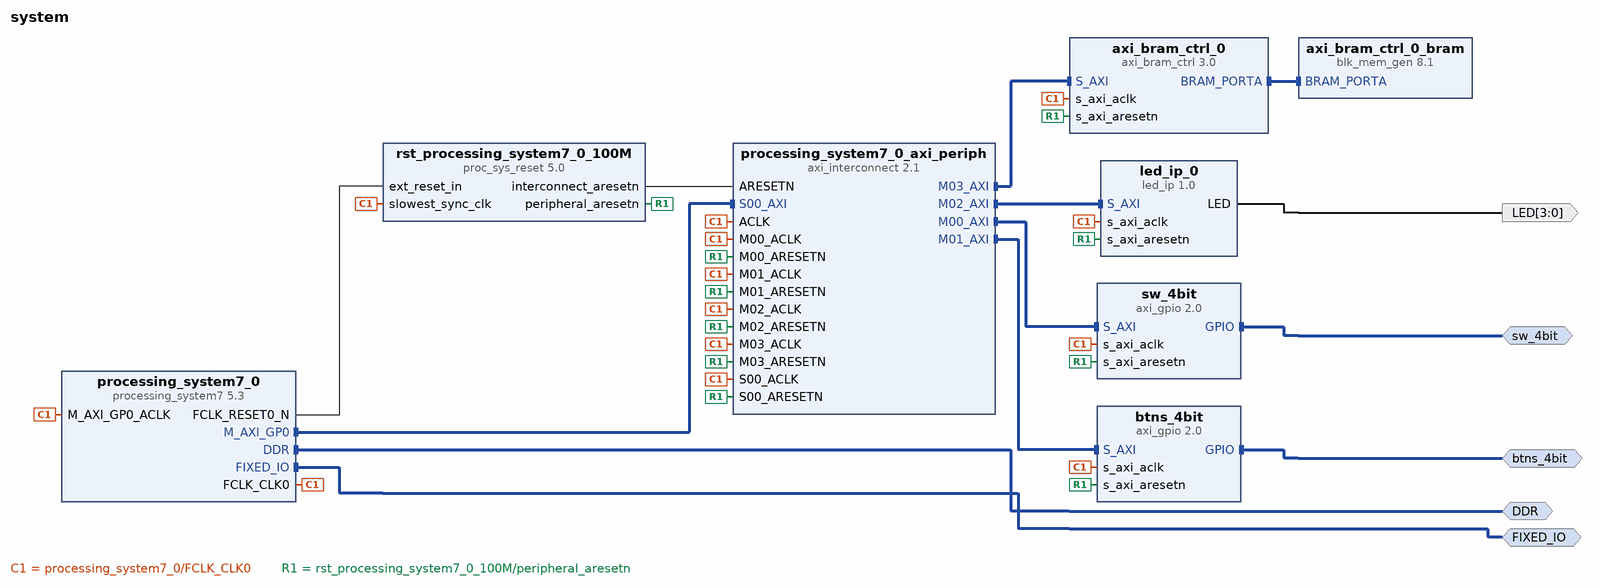
[diagram p0: block diagram of the top level]
# Vivado block design system, Vivado 2013.4
create_bd_design system

create_bd_intf_port -mode Master -vlnv xilinx.com:interface:ddrx_rtl:1.0 DDR
create_bd_intf_port -mode Master -vlnv xilinx.com:display_processing_system7:fixedio_rtl:1.0 FIXED_IO
create_bd_intf_port -mode Master -vlnv xilinx.com:interface:gpio_rtl:1.0 sw_4bit
create_bd_intf_port -mode Master -vlnv xilinx.com:interface:gpio_rtl:1.0 btns_4bit
create_bd_port -dir O -from 3 -to 0 LED

create_bd_cell -type ip -vlnv xilinx.com:ip:processing_system7:5.3 processing_system7_0
set_property -dict [list \
  CONFIG.PCW_IMPORT_BOARD_PRESET C:/xup/embedded/sources/ps7_system_prj.xml \
  CONFIG.PCW_QSPI_PERIPHERAL_ENABLE 0 \
  CONFIG.PCW_ENET0_PERIPHERAL_ENABLE 0 \
  CONFIG.PCW_SD0_PERIPHERAL_ENABLE 0 \
  CONFIG.PCW_USB0_PERIPHERAL_ENABLE 0 \
] [get_bd_cells processing_system7_0]
# 4 more settings of processing_system7_0 are not shown: defaults, MIO pin electricals, DDR timing, and values the tool derives
create_bd_cell -type ip -vlnv xilinx.com:ip:axi_gpio:2.0 sw_4bit
set_property -dict {CONFIG.C_GPIO_WIDTH 4 CONFIG.C_ALL_INPUTS 1} [get_bd_cells sw_4bit]
create_bd_cell -type ip -vlnv xilinx.com:ip:axi_interconnect:2.1 processing_system7_0_axi_periph
set_property -dict {CONFIG.NUM_MI 4} [get_bd_cells processing_system7_0_axi_periph]
create_bd_cell -type ip -vlnv xilinx.com:ip:proc_sys_reset:5.0 rst_processing_system7_0_100M
create_bd_cell -type ip -vlnv xilinx.com:ip:axi_gpio:2.0 btns_4bit
set_property -dict {CONFIG.C_GPIO_WIDTH 4 CONFIG.C_ALL_INPUTS 1} [get_bd_cells btns_4bit]
create_bd_cell -type ip -vlnv xilinx.com:user:led_ip:1.0 led_ip_0
create_bd_cell -type ip -vlnv xilinx.com:ip:axi_bram_ctrl:3.0 axi_bram_ctrl_0
set_property -dict {CONFIG.SINGLE_PORT_BRAM 1} [get_bd_cells axi_bram_ctrl_0]
create_bd_cell -type ip -vlnv xilinx.com:ip:blk_mem_gen:8.1 axi_bram_ctrl_0_bram

# ---- connections ----

connect_bd_intf_net [get_bd_intf_pins processing_system7_0/M_AXI_GP0] [get_bd_intf_pins processing_system7_0_axi_periph/S00_AXI]
connect_bd_intf_net [get_bd_intf_pins processing_system7_0_axi_periph/M00_AXI] [get_bd_intf_pins sw_4bit/S_AXI]
connect_bd_intf_net [get_bd_intf_pins btns_4bit/S_AXI] [get_bd_intf_pins processing_system7_0_axi_periph/M01_AXI]
connect_bd_intf_net [get_bd_intf_pins processing_system7_0_axi_periph/M02_AXI] [get_bd_intf_pins led_ip_0/S_AXI]
connect_bd_intf_net [get_bd_intf_pins processing_system7_0_axi_periph/M03_AXI] [get_bd_intf_pins axi_bram_ctrl_0/S_AXI]
connect_bd_intf_net [get_bd_intf_pins axi_bram_ctrl_0_bram/BRAM_PORTA] [get_bd_intf_pins axi_bram_ctrl_0/BRAM_PORTA]
connect_bd_intf_net [get_bd_intf_ports DDR] [get_bd_intf_pins processing_system7_0/DDR]
connect_bd_intf_net [get_bd_intf_ports FIXED_IO] [get_bd_intf_pins processing_system7_0/FIXED_IO]
connect_bd_intf_net [get_bd_intf_ports sw_4bit] [get_bd_intf_pins sw_4bit/GPIO]
connect_bd_intf_net [get_bd_intf_ports btns_4bit] [get_bd_intf_pins btns_4bit/GPIO]
connect_bd_net [get_bd_pins processing_system7_0/FCLK_CLK0] \
  [get_bd_pins processing_system7_0/M_AXI_GP0_ACLK] [get_bd_pins processing_system7_0_axi_periph/S00_ACLK] \
  [get_bd_pins rst_processing_system7_0_100M/slowest_sync_clk] [get_bd_pins processing_system7_0_axi_periph/ACLK] \
  [get_bd_pins sw_4bit/s_axi_aclk] [get_bd_pins processing_system7_0_axi_periph/M00_ACLK] [get_bd_pins btns_4bit/s_axi_aclk] \
  [get_bd_pins processing_system7_0_axi_periph/M01_ACLK] [get_bd_pins led_ip_0/s_axi_aclk] \
  [get_bd_pins processing_system7_0_axi_periph/M02_ACLK] [get_bd_pins axi_bram_ctrl_0/s_axi_aclk] \
  [get_bd_pins processing_system7_0_axi_periph/M03_ACLK]
connect_bd_net [get_bd_pins processing_system7_0/FCLK_RESET0_N] [get_bd_pins rst_processing_system7_0_100M/ext_reset_in]
connect_bd_net [get_bd_pins rst_processing_system7_0_100M/peripheral_aresetn] \
  [get_bd_pins processing_system7_0_axi_periph/S00_ARESETN] [get_bd_pins sw_4bit/s_axi_aresetn] \
  [get_bd_pins processing_system7_0_axi_periph/M00_ARESETN] [get_bd_pins btns_4bit/s_axi_aresetn] \
  [get_bd_pins processing_system7_0_axi_periph/M01_ARESETN] [get_bd_pins led_ip_0/s_axi_aresetn] \
  [get_bd_pins processing_system7_0_axi_periph/M02_ARESETN] [get_bd_pins axi_bram_ctrl_0/s_axi_aresetn] \
  [get_bd_pins processing_system7_0_axi_periph/M03_ARESETN]
connect_bd_net [get_bd_pins rst_processing_system7_0_100M/interconnect_aresetn] [get_bd_pins processing_system7_0_axi_periph/ARESETN]
connect_bd_net [get_bd_pins led_ip_0/LED] [get_bd_ports LED]

# ---- address map ----
assign_bd_address -offset 0x40000000 -range 8K -target_address_space [get_bd_addr_spaces processing_system7_0/Data] [get_bd_addr_segs axi_bram_ctrl_0/S_AXI/Mem0]
assign_bd_address -offset 0x41200000 -range 64K -target_address_space [get_bd_addr_spaces processing_system7_0/Data] [get_bd_addr_segs sw_4bit/S_AXI/Reg]
assign_bd_address -offset 0x41210000 -range 64K -target_address_space [get_bd_addr_spaces processing_system7_0/Data] [get_bd_addr_segs btns_4bit/S_AXI/Reg]
assign_bd_address -offset 0x43C00000 -range 4K -target_address_space [get_bd_addr_spaces processing_system7_0/Data] [get_bd_addr_segs led_ip_0/S_AXI/S_AXI_reg]

validate_bd_design
save_bd_design
